# Altium project Michel_Project.PrjPcb
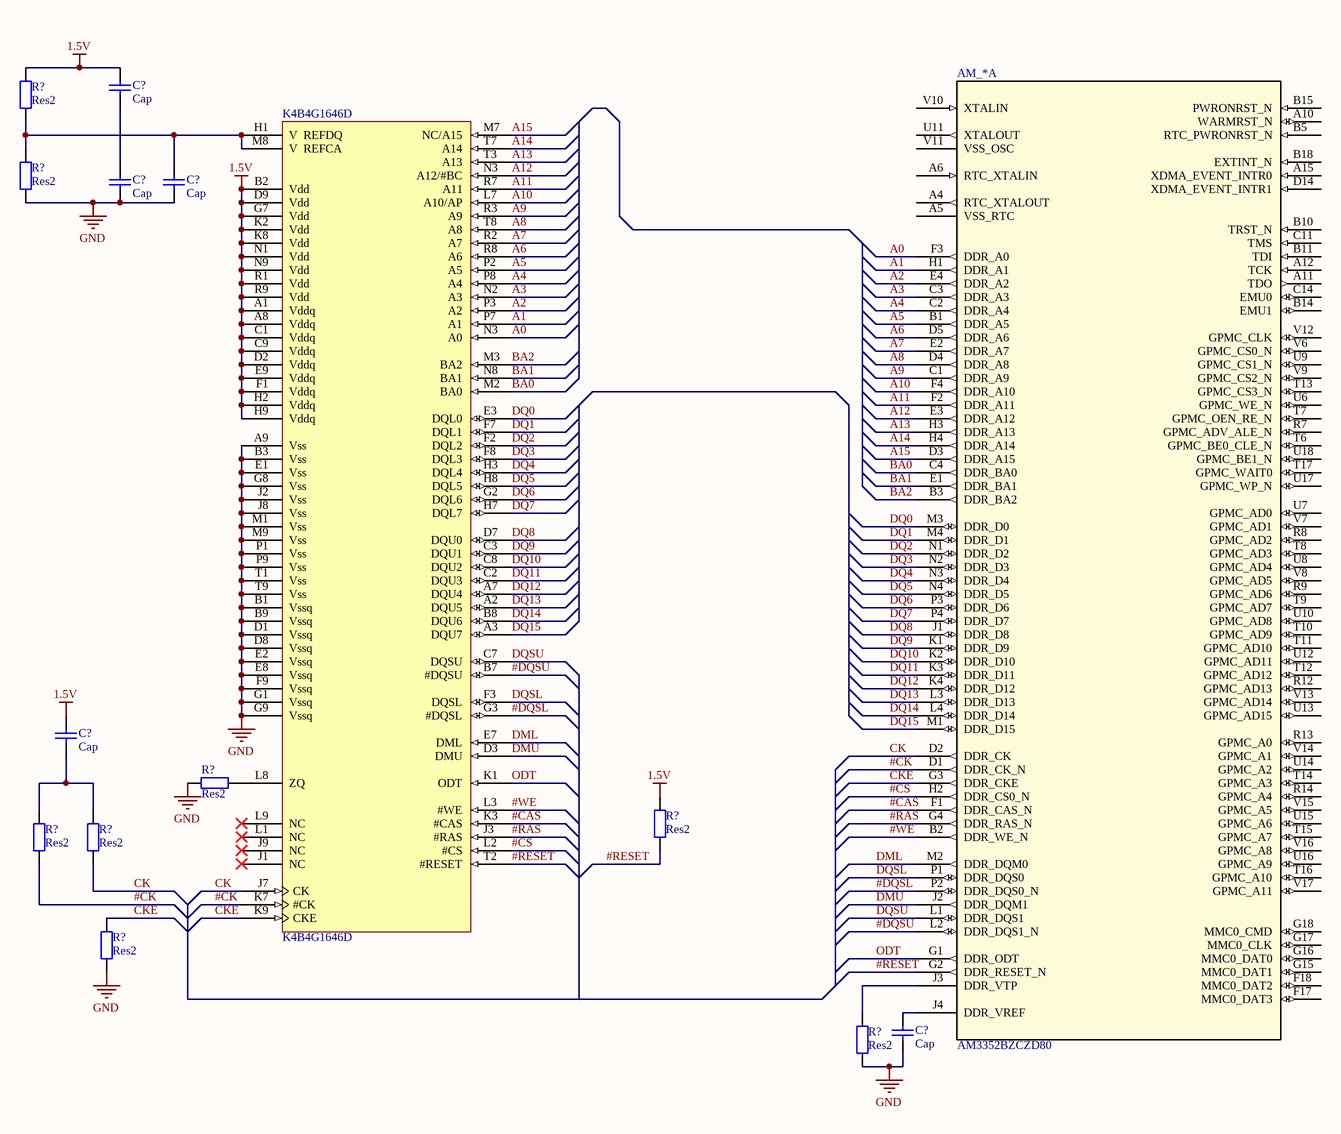
[diagram p0: DDR3.SchDoc]
1 sheet, 15 parts. Net scope: global (net labels, ports and power ports of the same name join across sheets).
Board file: PCB1.PcbDoc

## Sheet DDR3.SchDoc
size A3

### Parts
(Parts that share a designator on the sheet are numbered #1, #2 ... from top to bottom, then left to right.)
AM_*  AM3352BZCZD80  [BGA324C80P18X18_800X1508X1508]  (part A of 4)
C?#1  Cap  [RAD-0.3]
C?#2  Cap  [RAD-0.3]
C?#3  Cap  [RAD-0.3]
C?#4  Cap  [RAD-0.3]
C?#5  Cap  [RAD-0.3]
K4B4G1646D  K4B4G1646D
R?#1  Res2  [AXIAL-0.4]
R?#2  Res2  [AXIAL-0.4]
R?#3  Res2  [AXIAL-0.4]
R?#4  Res2  [AXIAL-0.4]
R?#5  Res2  [AXIAL-0.4]
R?#6  Res2  [AXIAL-0.4]
R?#7  Res2  [AXIAL-0.4]
R?#8  Res2  [AXIAL-0.4]

### Nets
1.5V: C?#1.2 C?#4.2 K4B4G1646D.A1(Vddq) K4B4G1646D.A8(Vddq) K4B4G1646D.B2(Vdd) K4B4G1646D.C1(Vddq) K4B4G1646D.C9(Vddq) K4B4G1646D.D2(Vddq) K4B4G1646D.D9(Vdd) K4B4G1646D.E9(Vddq) K4B4G1646D.F1(Vddq) K4B4G1646D.G7(Vdd) K4B4G1646D.H2(Vddq) K4B4G1646D.H9(Vddq) K4B4G1646D.K2(Vdd) K4B4G1646D.K8(Vdd) K4B4G1646D.N1(Vdd) K4B4G1646D.N9(Vdd) K4B4G1646D.R1(Vdd) K4B4G1646D.R9(Vdd) R?#1.2 R?#4.2
GND: C?#2.1 C?#3.1 C?#5.1 K4B4G1646D.A9(Vss) K4B4G1646D.B1(Vssq) K4B4G1646D.B3(Vss) K4B4G1646D.B9(Vssq) K4B4G1646D.D1(Vssq) K4B4G1646D.D8(Vssq) K4B4G1646D.E1(Vss) K4B4G1646D.E2(Vssq) K4B4G1646D.E8(Vssq) K4B4G1646D.F9(Vssq) K4B4G1646D.G1(Vssq) K4B4G1646D.G8(Vss) K4B4G1646D.G9(Vssq) K4B4G1646D.J2(Vss) K4B4G1646D.J8(Vss) K4B4G1646D.M1(Vss) K4B4G1646D.M9(Vss) K4B4G1646D.P1(Vss) K4B4G1646D.P9(Vss) K4B4G1646D.T1(Vss) K4B4G1646D.T9(Vss) R?#2.1 R?#3.1 R?#7.1 R?#8.1
#CAS: AM_*.F1(DDR_CAS_N) K4B4G1646D.K3(#CAS)
#CK: AM_*.D1(DDR_CK_N) K4B4G1646D.K7(#CK) R?#5.1
#CS: AM_*.H2(DDR_CS0_N) K4B4G1646D.L2(#CS)
#DQSL: AM_*.P2(DDR_DQS0_N) K4B4G1646D.G3(#DQSL)
#DQSU: AM_*.L2(DDR_DQS1_N) K4B4G1646D.B7(#DQSU)
#RAS: AM_*.G4(DDR_RAS_N) K4B4G1646D.J3(#RAS)
#RESET: AM_*.G2(DDR_RESET_N) K4B4G1646D.T2(#RESET) R?#4.1
#WE: AM_*.B2(DDR_WE_N) K4B4G1646D.L3(#WE)
A0: AM_*.F3(DDR_A0) K4B4G1646D.N3(A0)
A1: AM_*.H1(DDR_A1) K4B4G1646D.P7(A1)
A2: AM_*.E4(DDR_A2) K4B4G1646D.P3(A2)
A3: AM_*.C3(DDR_A3) K4B4G1646D.N2(A3)
A4: AM_*.C2(DDR_A4) K4B4G1646D.P8(A4)
A5: AM_*.B1(DDR_A5) K4B4G1646D.P2(A5)
A6: AM_*.D5(DDR_A6) K4B4G1646D.R8(A6)
A7: AM_*.E2(DDR_A7) K4B4G1646D.R2(A7)
A8: AM_*.D4(DDR_A8) K4B4G1646D.T8(A8)
A9: AM_*.C1(DDR_A9) K4B4G1646D.R3(A9)
A10: AM_*.F4(DDR_A10) K4B4G1646D.L7(A10/AP)
A11: AM_*.F2(DDR_A11) K4B4G1646D.R7(A11)
A12: AM_*.E3(DDR_A12) K4B4G1646D.N3(A12/#BC)
A13: AM_*.H3(DDR_A13) K4B4G1646D.T3(A13)
A14: AM_*.H4(DDR_A14) K4B4G1646D.T7(A14)
A15: AM_*.D3(DDR_A15) K4B4G1646D.M7(NC/A15)
BA0: AM_*.C4(DDR_BA0) K4B4G1646D.M2(BA0)
BA1: AM_*.E1(DDR_BA1) K4B4G1646D.N8(BA1)
BA2: AM_*.B3(DDR_BA2) K4B4G1646D.M3(BA2)
CK: AM_*.D2(DDR_CK) K4B4G1646D.J7(CK) R?#6.1
CKE: AM_*.G3(DDR_CKE) K4B4G1646D.K9(CKE) R?#7.2
DML: AM_*.M2(DDR_DQM0) K4B4G1646D.E7(DML)
DMU: AM_*.J2(DDR_DQM1) K4B4G1646D.D3(DMU)
DQ0: AM_*.M3(DDR_D0) K4B4G1646D.E3(DQL0)
DQ1: AM_*.M4(DDR_D1) K4B4G1646D.F7(DQL1)
DQ2: AM_*.N1(DDR_D2) K4B4G1646D.F2(DQL2)
DQ3: AM_*.N2(DDR_D3) K4B4G1646D.F8(DQL3)
DQ4: AM_*.N3(DDR_D4) K4B4G1646D.H3(DQL4)
DQ5: AM_*.N4(DDR_D5) K4B4G1646D.H8(DQL5)
DQ6: AM_*.P3(DDR_D6) K4B4G1646D.G2(DQL6)
DQ7: AM_*.P4(DDR_D7) K4B4G1646D.H7(DQL7)
DQ8: AM_*.J1(DDR_D8) K4B4G1646D.D7(DQU0)
DQ9: AM_*.K1(DDR_D9) K4B4G1646D.C3(DQU1)
DQ10: AM_*.K2(DDR_D10) K4B4G1646D.C8(DQU2)
DQ11: AM_*.K3(DDR_D11) K4B4G1646D.C2(DQU3)
DQ12: AM_*.K4(DDR_D12) K4B4G1646D.A7(DQU4)
DQ13: AM_*.L3(DDR_D13) K4B4G1646D.A2(DQU5)
DQ14: AM_*.L4(DDR_D14) K4B4G1646D.B8(DQU6)
DQ15: AM_*.M1(DDR_D15) K4B4G1646D.A3(DQU7)
DQSL: AM_*.P1(DDR_DQS0) K4B4G1646D.F3(DQSL)
DQSU: AM_*.L1(DDR_DQS1) K4B4G1646D.C7(DQSU)
ODT: AM_*.G1(DDR_ODT) K4B4G1646D.K1(ODT)
NetAM_*_J3: AM_*.J3(DDR_VTP) R?#8.2
NetAM_*_J4: AM_*.J4(DDR_VREF) C?#5.2
NetC?#1_1: C?#1.1 C?#2.2
NetC?#3_2: C?#3.2 K4B4G1646D.H1(V__REFDQ) K4B4G1646D.M8(V__REFCA) R?#1.1 R?#2.2
NetC?#4_1: C?#4.1 R?#5.2 R?#6.2
NetK4B4G1646D_L8: K4B4G1646D.L8(ZQ) R?#3.2

Not connected (* = marked no-connect by the designer): AM_* A4(RTC_XTALOUT) A5(VSS_RTC) A6(RTC_XTALIN) A10(WARMRST_N) A11(TDO) A12(TCK) A15(XDMA_EVENT_INTR0) B5(RTC_PWRONRST_N) B10(TRST_N) B11(TDI) B14(EMU1) B15(PWRONRST_N) B18(EXTINT_N) C11(TMS) C14(EMU0) D14(XDMA_EVENT_INTR1) F17(MMC0_DAT3) F18(MMC0_DAT2) G15(MMC0_DAT1) G16(MMC0_DAT0) G17(MMC0_CLK) G18(MMC0_CMD) R7(GPMC_ADV_ALE_N) R8(GPMC_AD2) R9(GPMC_AD6) R12(GPMC_AD13) R13(GPMC_A0) R14(GPMC_A4) T6(GPMC_BE0_CLE_N) T7(GPMC_OEN_RE_N) T8(GPMC_AD3) T9(GPMC_AD7) T10(GPMC_AD9) T11(GPMC_AD10) T12(GPMC_AD12) T13(GPMC_CS3_N) T14(GPMC_A3) T15(GPMC_A7) T16(GPMC_A10) T17(GPMC_WAIT0) U6(GPMC_WE_N) U7(GPMC_AD0) U8(GPMC_AD4) U9(GPMC_CS1_N) U10(GPMC_AD8) U11(XTALOUT) U12(GPMC_AD11) U13(GPMC_AD15) U14(GPMC_A2) U15(GPMC_A6) U16(GPMC_A9) U17(GPMC_WP_N) U18(GPMC_BE1_N) V6(GPMC_CS0_N) V7(GPMC_AD1) V8(GPMC_AD5) V9(GPMC_CS2_N) V10(XTALIN) V11(VSS_OSC) V12(GPMC_CLK) V13(GPMC_AD14) V14(GPMC_A1) V15(GPMC_A5) V16(GPMC_A8) V17(GPMC_A11); K4B4G1646D J1(NC)* J9(NC)* L1(NC)* L9(NC)*

### Notes on the sheet
- Title
- Size:
- Date:
- A3
- Number:
- Time:
- Revision:
- Sheet
- of
- File:

### Library data of the parts
AM_* = AM3352BZCZD80: Microprocesseur ARM; Manufacturer: Texas Instruments; Fabricant: Texas Instrument; Fournisseur: Farnell; RefFabricant: AM3352BZCZ100; RefFournisseur: 2494119; PartNumber: AM3352BZCZD80; RefDes: RefDes; TYPE: TYPE; Value: Value
C?#1-C?#5 = Cap: Capacitor; Value: 100pF; Published: 8-Jun-2000; LatestRevisionDate: 17-Jul-2002; LatestRevisionNote: Re-released for DXP Platform.; PackageReference: RAD-0.3; Publisher: Altium Limited; PackageDescription: Radial Cap, Thru-Hole; 2 Leads; 0.3 in Pin Spacing
K4B4G1646D = K4B4G1646D: Mémoire DDR3/SRAM; Fabricant: Samsung; Fournisseur: Olimex; RefFabricant: DS_K4B4G1646D; RefFournisseur: K4B4G1646D-BCK0; K4B4G1646D: *
R?#1-R?#8 = Res2: Resistor; Value: 1K; Published: 8-Jun-2000; LatestRevisionDate: 17-Jul-2002; LatestRevisionNote: Re-released for DXP Platform.; PackageReference: AXIAL-0.4; Publisher: Altium Limited; PackageDescription: Axial Device, Thru-Hole; 2 Leads; 0.4 in Pin Spacing